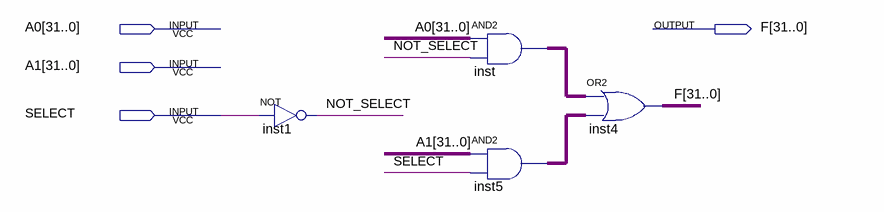
[diagram p0: schematic sheet]
// Quartus schematic MPX2_32.bdf as structural Verilog: 4 symbols, 4 pins
module MPX2_32 (
  input  [31:0] A0,
  input  [31:0] A1,
  input  SELECT,
  output [31:0] F
);

  wire NOT_SELECT;
  wire [31:0] inst5_out, inst_out;

  not inst1 (NOT_SELECT, SELECT);
  assign inst_out = A0 & {32{NOT_SELECT}};  // AND2 inst, 32 bits wide
  assign inst5_out = A1 & {32{SELECT}};  // AND2 inst5, 32 bits wide
  assign F = inst_out | inst5_out;  // OR2 inst4, 32 bits wide
endmodule
